# Altium schematic sheet current_measure.SchDoc: Current-measure Section
size A4; Author: Robocup; Organization: Hamburg Bit-Bots; Address1: Vogt-Kölln-Str. 30; Address2: 225257 Hamburg; Address3: Germany; Address4: www.bit-bots.de; DocumentNumber: 5; Revision: A; SheetNumber: 5; SheetTotal: 7; EMail: info@bit-bots.de
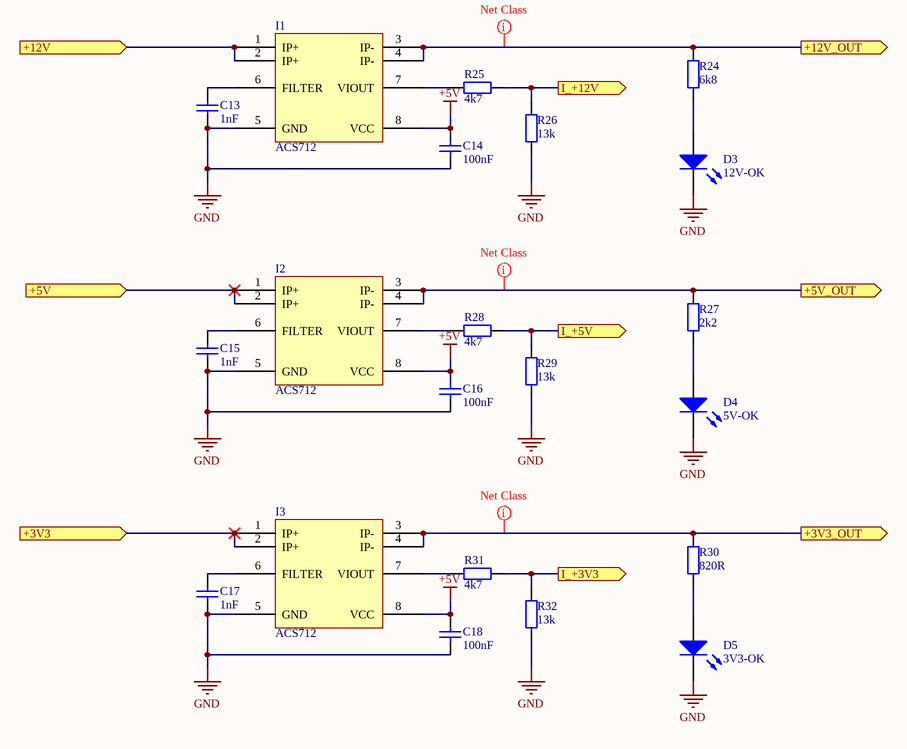
[diagram p0: current_measure.SchDoc]

## Parts
C13  1nF  [C2012]
C14  100nF  [C2012]
C15  1nF  [C2012]
C16  100nF  [C2012]
C17  1nF  [C2012]
C18  100nF  [C2012]
D3  12V-OK  [MLCC2]
D4  5V-OK  [MLCC2]
D5  3V3-OK  [MLCC2]
I1  ACS712  [SOIC8]
I2  ACS712  [SOIC8]
I3  ACS712  [SOIC8]
R24  6k8  [R2012]
R25  4k7  [R2012]
R26  13k  [R2012]
R27  2k2  [R2012]
R28  4k7  [R2012]
R29  13k  [R2012]
R30  820R  [R2012]
R31  4k7  [R2012]
R32  13k  [R2012]

## Ports
+3V3 (in), +3V3_OUT (out), +5V (in), +5V_OUT (out), +12V (in), +12V_OUT (out), I_+3V3 (out), I_+5V (out), I_+12V (out)

## Nets
+5V: C14.2 C16.2 C18.2 I1.8(VCC) I2.8(VCC) I3.8(VCC)
GND: C13.1 C14.1 C15.1 C16.1 C17.1 C18.1 D3.2(K) D4.2(K) D5.2(K) I1.5(GND) I2.5(GND) I3.5(GND) R26.2 R29.2 R32.2
+3V3: I3.1(IP+) I3.2(IP+) ; port +3V3
+3V3_OUT: I3.3(IP-) I3.4(IP-) R30.2 ; port +3V3_OUT
+5V: I2.1(IP+) I2.2(IP+) ; port +5V  [a separate net that carries the same name]
+5V_OUT: I2.3(IP-) I2.4(IP-) R27.2 ; port +5V_OUT
+12V: I1.1(IP+) I1.2(IP+) ; port +12V
+12V_OUT: I1.3(IP-) I1.4(IP-) R24.2 ; port +12V_OUT
I_+3V3: R31.2 R32.1 ; port I_+3V3
I_+5V: R28.2 R29.1 ; port I_+5V
I_+12V: R25.2 R26.1 ; port I_+12V
NetC13_2: C13.2 I1.6(FILTER)
NetC15_2: C15.2 I2.6(FILTER)
NetC17_2: C17.2 I3.6(FILTER)
NetD3_1: D3.1(A) R24.1
NetD4_1: D4.1(A) R27.1
NetD5_1: D5.1(A) R30.1
NetI1_7: I1.7(VIOUT) R25.1
NetI2_7: I2.7(VIOUT) R28.1
NetI3_7: I3.7(VIOUT) R31.1

## Layout directives
net class HighCurrent: +3V3_OUT, +5V_OUT, +12V_OUT

## Notes on the sheet
- Project:
- Author:
- Title:
- Rev:
- Date:
- Time:
- Sheet
- of

## Library data of the parts
C13-C18 = Cap: Capacitor; Published: 8-Jun-2000; LatestRevisionDate: 17-Jul-2002; LatestRevisionNote: Re-released for DXP Platform.; PackageReference: RAD-0.3; Publisher: Altium Limited; PackageDescription: Radial Cap, Thru-Hole; 2 Leads; 0.3 in Pin Spacing
  C13 C15 C17: Value: 1nF
  C14 C16 C18: Value: 100nF
D3-D5 = LED0: Green; Published: 8-Jun-2000; LatestRevisionDate: 08-Jul-2005; LatestRevisionNote: Mech Layer 1 removed.; PackageReference: LED-0; Publisher: Altium Limited; PackageDescription: LED; 2 Leads
I1-I3 = ACS712: Fully Integrated, Hall Effect-Based Linear Current Sensor IC with 2.1 kVRMS Isolation and a Low-Resistance Current Conductor
R24-R32 = Res2: Resistor; Published: 8-Jun-2000; LatestRevisionDate: 17-Jul-2002; LatestRevisionNote: Re-released for DXP Platform.; PackageReference: AXIAL-0.4; Publisher: Altium Limited; PackageDescription: Axial Device, Thru-Hole; 2 Leads; 0.4 in Pin Spacing
  R24: Value: 6k8
  R25 R28 R31: Value: 4k7
  R26 R29 R32: Value: 13k
  R27: Value: 2k2
  R30: Value: 820R